# Altium project Driver Morpheu v4.0 SMD.PrjPcb
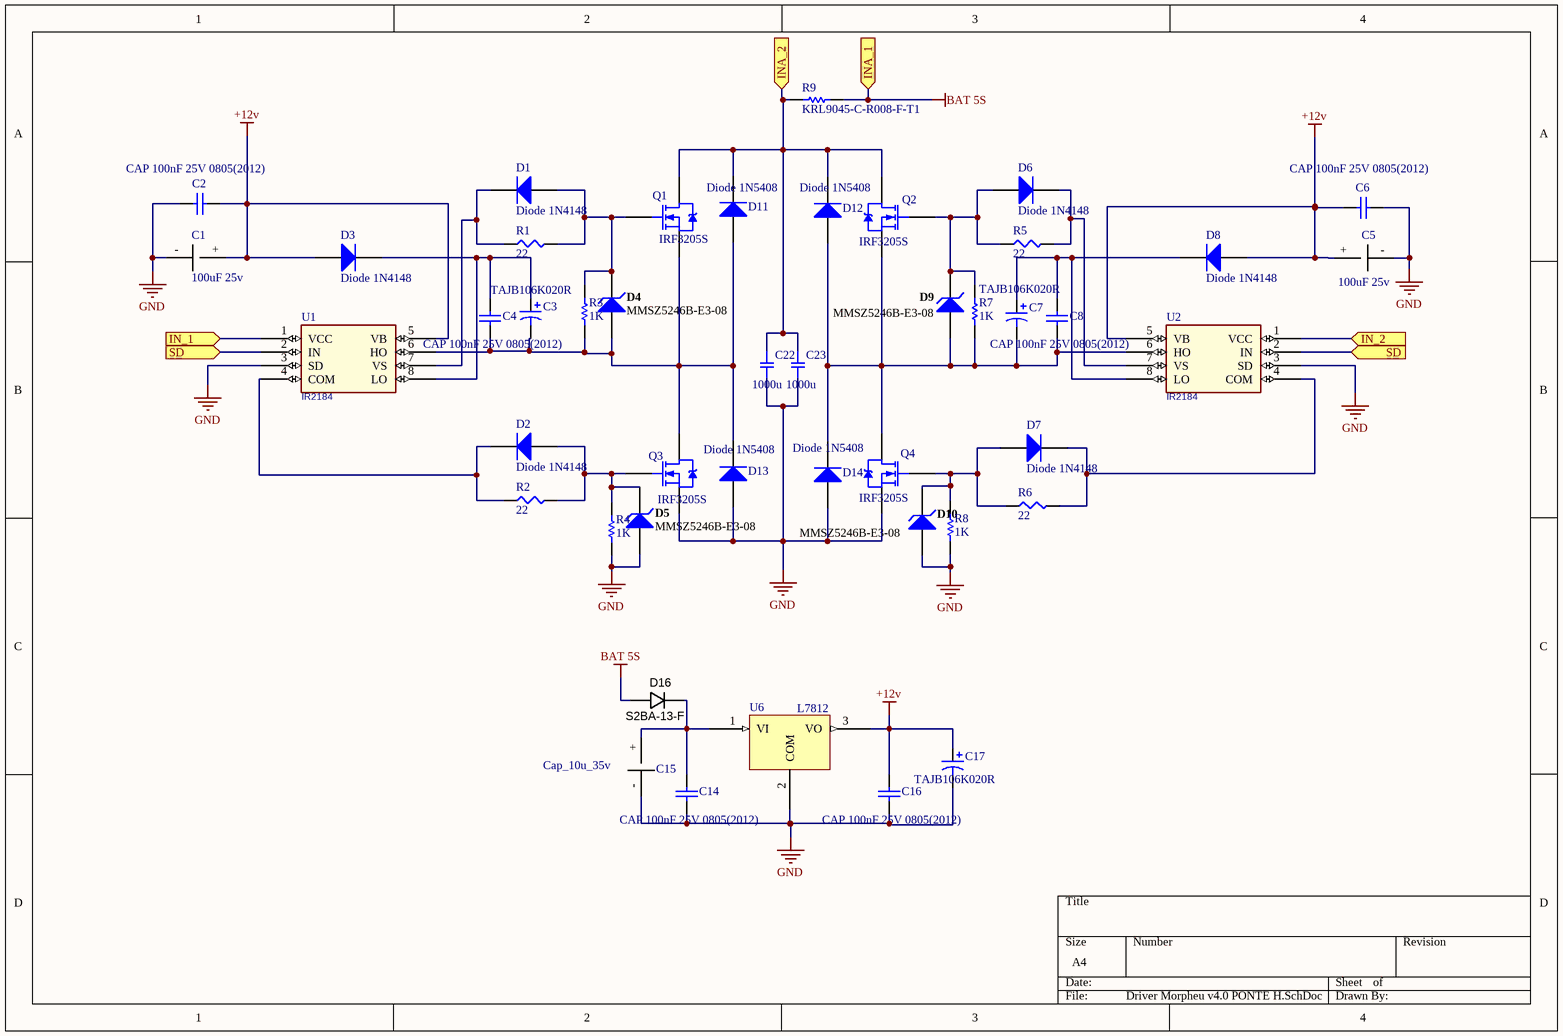
[diagram p0: Driver Morpheu v4.0 PONTE H.SchDoc]
3 sheets, 74 parts. Net scope: flat (ports and power ports of the same name join across sheets).
Board file: Driver Morpheu v4.0.PcbDoc
Sheets:
  Driver Morpheu v4.0 PONTE H.SchDoc
  Driver Morpheu v4.0 CENTRAL.SchDoc
  Driver Morpheu v4.0 SENSOR CORRENTE.SchDoc

## Sheet Driver Morpheu v4.0 PONTE H.SchDoc
size A4

### Parts
C1  100uF 25v  [CAP_100u_25v_Tantalum]
C2  CAP 100nF 25V 0805(2012)  [CAPC0805(2012)145_M]
C3  TAJB106K020R  [AVX-CAPC3528_V]
C4  CAP 100nF 25V 0805(2012)  [CAPC0805(2012)145_M]
C5  100uF 25v  [CAP_100u_25v_Tantalum]
C6  CAP 100nF 25V 0805(2012)  [CAPC0805(2012)145_M]
C7  TAJB106K020R  [AVX-CAPC3528_V]
C8  CAP 100nF 25V 0805(2012)  [CAPC0805(2012)145_M]
C14  CAP 100nF 25V 0805(2012)  [CAPC0805(2012)145_M]
C15  Cap_10u_35v  [CAP_100u_25v_Tantalum]
C16  CAP 100nF 25V 0805(2012)  [CAPC0805(2012)145_M]
C17  TAJB106K020R  [AVX-CAPC3528_V]
C22  1000u  [CAPAE250P680X1220_FLAT1]
C23  1000u  [CAPAE250P680X1220_FLAT1]
D1  Diode 1N4148  [SOD123]
D2  Diode 1N4148  [SOD123]
D3  Diode 1N4148  [SOD123]
D4  MMSZ5246B-E3-08  [VISH-SOD-123-2_V]
D5  MMSZ5246B-E3-08  [VISH-SOD-123-2_V]
D6  Diode 1N4148  [SOD123]
D7  Diode 1N4148  [SOD123]
D8  Diode 1N4148  [SOD123]
D9  MMSZ5246B-E3-08  [VISH-SOD-123-2_V]
D10  MMSZ5246B-E3-08  [VISH-SOD-123-2_V]
D11  Diode 1N5408  [DO-201AD]
D12  Diode 1N5408  [DO-201AD]
D13  Diode 1N5408  [DO-201AD]
D14  Diode 1N5408  [DO-201AD]
D16  Manufacturer Part Number 1: S2BA-13-F  [DO-214AC]  (hidden comment: 100V; 1.5A)
Q1  IRF3205S  [D2PAK_N]
Q2  IRF3205S  [D2PAK_N]
Q3  IRF3205S  [D2PAK_N]
Q4  IRF3205S  [D2PAK_N]
R1  22  [SMD-0603-RES]
R2  22  [SMD-0603-RES]
R3  value 1K  [RES-0402]  (hidden comment: RC0402JR-071KL)
R4  value 1K  [RES-0402]  (hidden comment: RC0402JR-071KL)
R5  22  [SMD-0603-RES]
R6  22  [SMD-0603-RES]
R7  value 1K  [RES-0402]  (hidden comment: RC0402JR-071KL)
R8  value 1K  [RES-0402]  (hidden comment: RC0402JR-071KL)
R9  KRL9045-C-R008-F-T1  [8m OHM 4W]
U1  IR2184  [SOIC127P600X175-8AN]
U2  IR2184  [SOIC127P600X175-8AN]
U6  L7812  [D2PAK-3]

### Ports
IN_1 (in), IN_2 (in), INA_1 (in), INA_2 (in), SD (in)

### Nets
+12v: C1.+ C2.2 C5.+ C6.2 C16.2 C17.1 D3.1(A) D8.1(A) U1.5(VB) U2.5(VB) U6.3(VO)
BAT 5S: D16.A R9.1 ; port INA_1
GND: C1.- C2.1 C5.- C6.1 C14.1 C15.- C16.1 C17.2 C22.2 C23.2 D5.1(A) D10.1(A) D13.1(A) D14.1(A) Q3.3(S) Q4.3(S) R4.1 R8.1 U1.3(SD) U2.3(SD) U6.2(COM)
NetC3_1: C3.1 C4.2 D3.2(K) U1.8(LO)
NetC3_2: C3.2 C4.1 D4.1(A) D11.1(A) D13.2(K) Q1.3(S) Q3.2(D) R3.1 U1.6(HO)
NetC7_1: C7.1 C8.2 D8.2(K) U2.8(LO)
NetC7_2: C7.2 C8.1 D9.1(A) D12.1(A) D14.2(K) Q2.3(S) Q4.2(D) R7.1 U2.6(HO)
NetC14_2: C14.2 C15.+ D16.K U6.1(VI)
NetC22_1: C22.1 C23.1 D11.2(K) D12.2(K) Q1.2(D) Q2.2(D) R9.2 ; port INA_2
NetD1_1: D1.1(A) D4.2(K) Q1.1(G) R1.2 R3.2
NetD1_2: D1.2(K) R1.1 U1.7(VS)
NetD2_1: D2.1(A) D5.2(K) Q3.1(G) R2.2 R4.2
NetD2_2: D2.2(K) R2.1 U1.4(COM)
NetD6_1: D6.1(A) D9.2(K) Q2.1(G) R5.1 R7.2
NetD6_2: D6.2(K) R5.2 U2.7(VS)
NetD7_1: D7.1(A) D10.2(K) Q4.1(G) R6.1 R8.2
NetD7_2: D7.2(K) R6.2 U2.4(COM)
NetDS2_1: U1.1(VCC) ; port IN_1
NetDS3_1: U2.1(VCC) ; port IN_2
NetU1_2: U1.2(IN) U2.2(IN) ; port SD

### Library data of the parts
C1 C5 = Cap_100u_25v: Cap Tântalo
C2 C4 C6 C8 C14 C16 = CMP-1036-04408-1: CAP 100nF 25V ±5% 0805 (2012 Metric) Thickness 1.45mm SMD; Case-Metric: 2012; Case-EIA: 0805; Tolerance: Â±5%; Value: 100nF; Rated Voltage: 25 V; Max Thickness: 1.45 mm; Technology: SMT
C3 C7 C17 = CMP-0279-00001-1: Capacitor, Tantalum, 10uF 10% 20V MCCT-B (3528); Manufacturer: AVX; Polarity: Polarized; PartNumber: TAJB106K020R; PackageDescription: 2-Pin SMT Capacitor, 3.5 x 2.8 mm Body; ComponentLink1URL: http://www.avx.com/; PackageReference: CAPC3528; ComponentLink2Description: Datasheet; Capacitance: 10uF; Technology: Tantalum; ComponentLink2URL: http://www.avx.com/docs/Catalogs/taj.pdf; Tolerance: 10%; ComponentLink1Description: Manufacturer URL; Rated Voltage: 20V; DatasheetVersion: Jun-13; Mounting Technology: Surface Mount
C22 C23 = CAPACITOR: CAP MLCC SMT
D1-D3 D6-D8 = Diode 1N4148: High Conductance Fast Diode; Published: 8-Jun-2000; LatestRevisionDate: 17-Jul-2002; LatestRevisionNote: Re-released for DXP Platform.; DatasheetVersion: 1997; PackageReference: DO-35; Publisher: Altium Limited; PackageDescription: Diode, Axial; Body 3.8 x 1.9 mm (LxDia. max), Lead Dia. 0.53 mm (max); Code_JEDEC: DO-204-AH; ComponentLink1Description: Manufacturer Link; ComponentLink1URL: http://www.fairchildsemi.com/; ComponentLink2Description: Datasheet; ComponentLink2URL: http://www.fairchildsemi.com/ds/1N%2F1N4148.pdf
D4 D5 D9 D10 = CMP-0931-00032-1: Small Signal Zener Diode, 16 V +/- 5%, -55 to 155 degC, 2-Pin SOD-123, RoHS, Tape and Reel; Manufacturer: Vishay Semiconductor; Test Current (IZT1) (mA): 7.8; Zener Impedance (IZT1) (Max.) (Ohm): 17; Int. Construction: Single; Tolerance: +/- 5%; Power Dissipation (mW): 500; Zener Voltage (NOM.) (V): 16; ComponentLink1URL: http://www.vishay.com/; PackageReference: SOD-123-2; PartNumber: MMSZ5246B-E3-08; ComponentLink2Description: Datasheet; Operating Temperature: -55 to 150 degC; PackageDescription: 2-Pin SMD, Body 2.7 x 1.55 mm, Height 1.35 mm; ComponentLink2URL: http://www.vishay.com/docs/85774/mmsz5225.pdf; DatasheetVersion: Rev. 1.9; RoHS: TRUE; Packing: Tape and Reel; ComponentLink1Description: Manufacturer URL; Mounting Technology: Surface Mount; PackageVersion: Rev. 1.9; ComponentLink3URL: http://www.vishay.com/docs/85774/mmsz5225.pdf; ComponentLink3Description: Package Specification
D11-D14 = Diode 1N5408: 3 Amp Medium Power Silicon Rectifier Diode; Published: 8-Jun-2000; LatestRevisionDate: 17-Jul-2002; LatestRevisionNote: Re-released for DXP Platform.; DatasheetVersion: Aug-1984; PackageReference: DO-201AD; Publisher: Altium Limited; PackageDescription: Diode, Axial; Body 9.5 x 5.3 mm (LxDia. max), Lead Dia. 1.32 mm (max); ComponentLink1Description: Manufacturer Link; ComponentLink1URL: http://www.irf.com/
D16 = DIODE_100V_1.5A_SMA: Diode SMD 100V 1.5A SMA; Manufacturer 1: Diodes Inc; Material: Si; Diode Type: Standard; Value: Vf = 1.15V @ 1.5A (Max); SCDType: source; Package / Case: DO-214AC, SMA; Ratings: 100V; 1.5A; Supplier 1: Digi-Key; Supplier Part Number 1: S2BA-FDICT-ND
Q1-Q4 = IRF3205S: HEXFET Power MOSFET; Published: 8-Jun-2000; LatestRevisionDate: 20-Nov-2009; LatestRevisionNote: IPC-7351 Footprint Added.; DatasheetVersion: Aug-1997; PackageReference: D2PAK; Publisher: Altium Limited; PackageDescription: 3-Pin Transistor Outline Package 2.54 mm Pitch, 15.1 mm Lead Span; ComponentLink1Description: Manufacturer Link; ComponentLink1URL: http://www.irf.com/; ComponentLink2Description: Datasheet; ComponentLink2URL: http://www.irf.com/product-info/datasheets/data/irf3205s.pdf
R1 R2 R5 R6 = ERJ-3EKF22R0V: RES SMD 22 OHM 1% 1/10W 0603; Manufacturer: Panasonic Electronic Components; Factory Stock: 0; Unit Price (USD): 0.00379; @ qty: 1500; Minimum Quantity: 1; Power (Watts): 0.1W, 1/10W; Temperature Coefficient: ±100ppm/°C; Part Number: ERJ-3EKF22R0V; Datasheets: http://industrial.panasonic.com/www-cgi/jvcr13pz.cgi?E+PZ+3+AOA0002+ERJ3EKF22R0V+7+WW; Image: //media.digikey.com/Photos/Panasonic%20Photos/MFG_ERJ-P6W%20Series.jpg; Digi-Key Part Number: P22.0HCT-ND; Quantity Available: 100321; Packaging: Cut Tape (CT); Series: ERJ; Part Status: Active; Value: 22; Tolerance: ±1%; Composition: Thick Film; Features: Automotive AEC-Q200; Operating Temperature: -55°C ~ 155°C; Package / Case: 0603 (1608 Metric); Supplier Device Package: 0603; Size / Dimension: 0.063" L x 0.031" W (1.60mm x 0.80mm); Height - Seated (Max): 0.022" (0.55mm); Number of Terminations: 2; Failure Rate: -
R3 R4 R7 R8 = RES 1K 0402: RES SMD 1K OHM 5% 1/16W 0402
R9 = CMP-1666-00018-2: Chip Resistor, 0.008 Ohm, +/- 1%, 4 W; PartNumber: WSLP12061L000FEA; Resistance: 0.001 Ohm; RoHSCompliant: True; Mounting Technology: Surface Mount; ComponentLink1URL: http://www.vishay.com/; Min Operating Temperature: -65 degC; Height: 0.635 mm; ComponentLink2URL: http://www.farnell.com/datasheets/2049155.pdf; Length: 3.2 mm; ComponentLink2Description: Datasheet; ComponentLink1Description: Manufacturer URL; DatasheetVersion: 04/2015; Case Code (Imperial): 1206; Max Operating Temperature: 170 degC; Packaging: Tape and Reel; Tolerance: 1%; Case/Package: 1206; Width: 1.6 mm; REACH SVHC: Unknown; PackageDescription: 2-Pin Surface Mount Device, Body 3.2 x 1.6 mm; Case Code (Metric): 3216
U1 U2 = IR2184: PSpiceTemplate: X^@REFDES %VCC %IN %SD %COM %VB %HO %VS %LO @MODEL PARAMS:  ?CDELAY|CDELAY=@CDELAY||CDELAY=50N| ?RDELAY|RDELAY=@RDELAY||RDELAY=50| ?T1|T1=@T1||T1=-40| ?T2|T2=@T2||T2=25| ?T3|T3=@T3||T3=125| ?V1|V1=@V1||V1=10| ?V2|V2=@V2||V2=15| ?V3|V3=@V3||V3=20| ?TOFFT1|TOFFT1=@TOFFT1||TOFFT1=270N| ?TOFFT2|TOFFT2=@TOFFT2||TOFFT2=270N| ?TOFFT3|TOFFT3=@TOFFT3||TOFFT3=270N| ?TOFFV1|TOFFV1=@TOFFV1||TOFFV1=270N| ?TOFFV2|TOFFV2=@TOFFV2||TOFFV2=270N| ?TOFFV3|TOFFV3=@TOFFV3||TOFFV3=270N| ?TONT1|TONT1=@TONT1||TONT1=210N| ?TONT2|TONT2=@TONT2||TONT2=210N| ?TONT3|TONT3=@TONT3||TONT3=210N| ?TONV1|TONV1=@TONV1||TONV1=210N| ?TONV2|TONV2=@TONV2||TONV2=210N| ?TONV3|TONV3=@TONV3||TONV3=210N|; TONV3: 210N; TOFFV3: 270N; V3: 20; V2: 15; V1: 10; T3: 125; T2: 25; T1: -40; RDELAY: 50; CDELAY: 50N; TONV2: 210N; TONV1: 210N; TONT3: 210N; TONT2: 210N; TONT1: 210N; TOFFV2: 270N; TOFFV1: 270N; TOFFT3: 270N; TOFFT2: 270N; TOFFT1: 270N
U6 = LM7812

## Sheet Driver Morpheu v4.0 CENTRAL.SchDoc
size A4
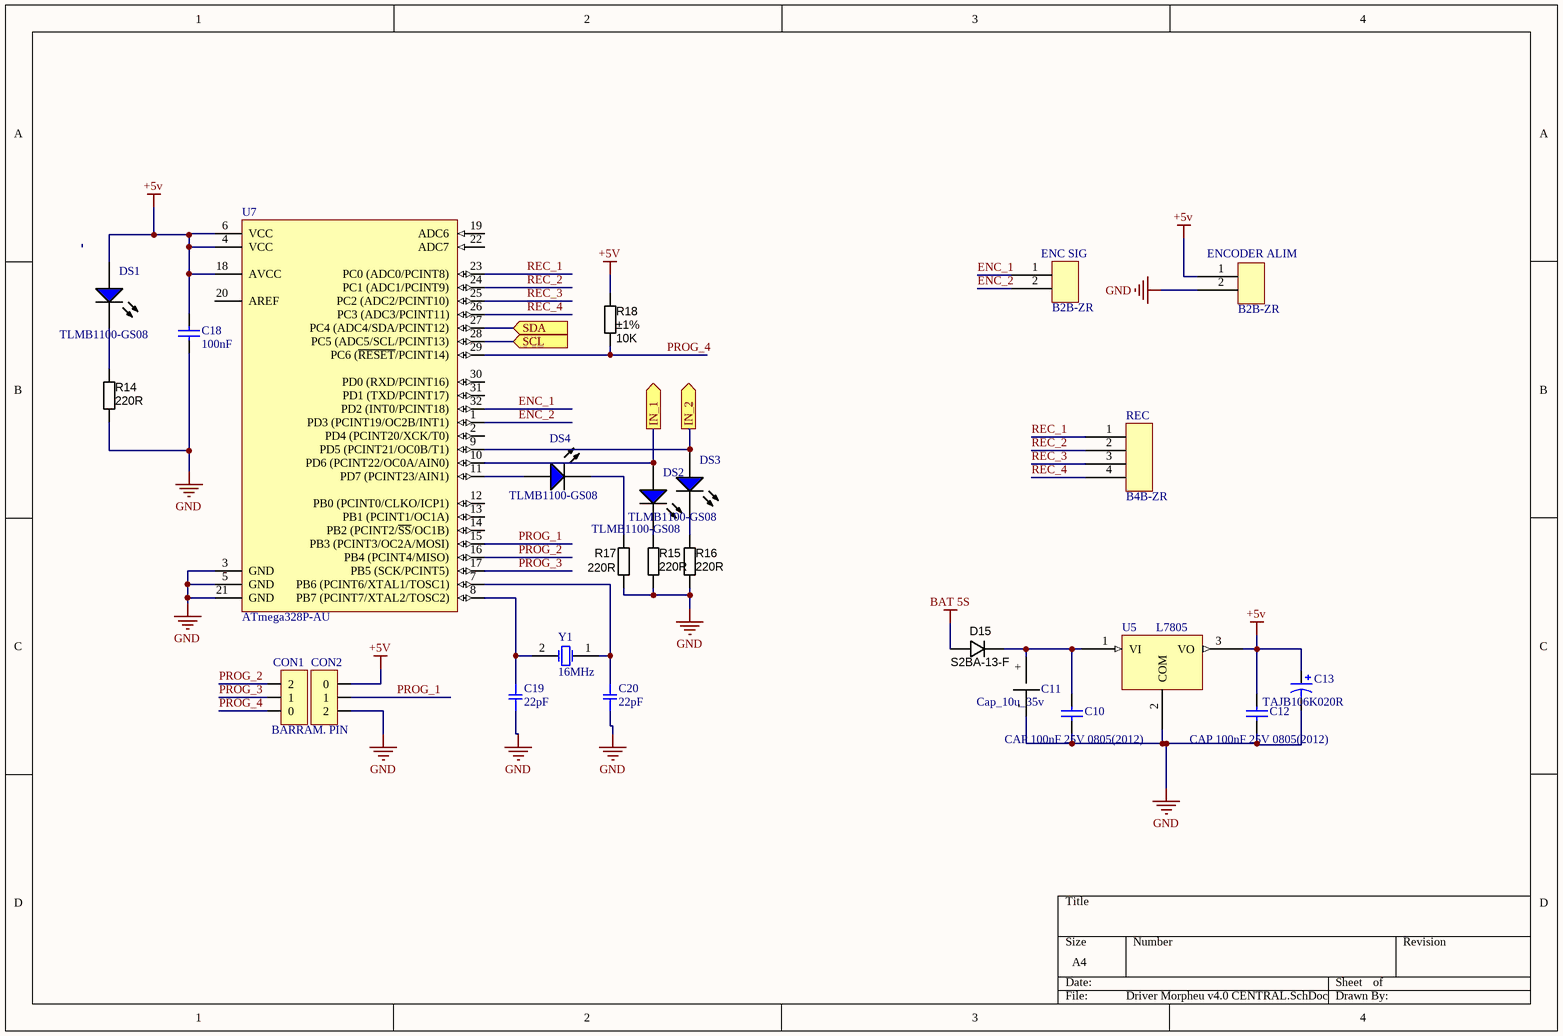
[diagram p1: Driver Morpheu v4.0 CENTRAL.SchDoc]

### Parts
C10  CAP 100nF 25V 0805(2012)  [CAPC0805(2012)145_M]
C11  Cap_10u_35v  [CAP_100u_25v_Tantalum]
C12  CAP 100nF 25V 0805(2012)  [CAPC0805(2012)145_M]
C13  TAJB106K020R  [AVX-CAPC3528_V]
C18  value 100nF  [CAP-0402]  (hidden comment: GRM155R71C104KA88D)
C19  22pF  [SMD-0603C]
C20  22pF  [SMD-0603C]
CON1  BARRAM. PIN  [1x3POS_HEADER]
CON2  (no value)  [1x3POS_HEADER]
D15  Manufacturer Part Number 1: S2BA-13-F  [DO-214AC]  (hidden comment: 100V; 1.5A)
DS1  TLMB1100-GS08  [VISH-TLMX1100-2_V]
DS2  TLMB1100-GS08  [VISH-TLMX1100-2_V]
DS3  TLMB1100-GS08  [VISH-TLMX1100-2_V]
DS4  TLMB1100-GS08  [VISH-TLMX1100-2_V]
ENC_SIG  B2B-ZR  [B2B-ZR]
ENCODER_ALIM  B2B-ZR  [B2B-ZR]
R14  value 220R  [RESC1608X55N]  (hidden comment: Thick Film)
R15  value 220R  [RESC1608X55N]  (hidden comment: Thick Film)
R16  value 220R  [RESC1608X55N]  (hidden comment: Thick Film)
R17  value 220R  [RESC1608X55N]  (hidden comment: Thick Film)
R18  value 10K  Tolerance: ±1%  [RESC1608X55N]  (hidden comment: Thick Film)
REC  B4B-ZR  [B4B-ZR]
U5  L7805  [D2PAK-3]
U7  ATmega328P-AU  [32A_N]
Y1  16MHz  [CRYSTAL_HC49-US-SM]

### Ports
IN_1 (out), IN_2 (out), SCL (in), SDA (in)

### Nets
+5V: C12.2 C13.1 C18.1 CON2.0 DS1.1(A) ENCODER_ALIM.1 R18.1 U5.3(VO) U7.4(VCC) U7.6(VCC) U7.18(AVCC)
BAT 5S: D15.A
GND: C10.1 C11.- C12.1 C13.2 C18.2 C19.1 C20.1 CON2.2 ENCODER_ALIM.2 R14.2 R15.2 R16.2 R17.2 U5.2(COM) U7.3(GND) U7.5(GND) U7.21(GND)
ENC_1: ENC_SIG.1 U7.32(PD2_(INT0/PCINT18))
ENC_2: ENC_SIG.2 U7.1(PD3_(PCINT19/OC2B/INT1))
PROG_1: CON2.1 U7.15(PB3_(PCINT3/OC2A/MOSI))
PROG_2: CON1.2 U7.16(PB4_(PCINT4/MISO))
PROG_3: CON1.1 U7.17(PB5_(SCK/PCINT5))
PROG_4: CON1.0 R18.2 U7.29(PC6_(~{RESET}/PCINT14))
REC_1: REC.1 U7.23(PC0_(ADC0/PCINT8))
REC_2: REC.2 U7.24(PC1_(ADC1/PCINT9))
REC_3: REC.3 U7.25(PC2_(ADC2/PCINT10))
REC_4: REC.4 U7.26(PC3_(ADC3/PCINT11))
NetC10_2: C10.2 C11.+ D15.K U5.1(VI)
NetC19_2: C19.2 U7.8(PB7_(PCINT7/XTAL2/TOSC2)) Y1.2(OSC2)
NetC20_2: C20.2 U7.7(PB6_(PCINT6/XTAL1/TOSC1)) Y1.1(OSC1)
NetDS1_2: DS1.2(K) R14.1
NetDS2_1: DS2.1(A) U7.10(PD6_(PCINT22/OC0A/AIN0)) ; port IN_1
NetDS2_2: DS2.2(K) R15.1
NetDS3_1: DS3.1(A) U7.9(PD5_(PCINT21/OC0B/T1)) ; port IN_2
NetDS3_2: DS3.2(K) R16.1
NetDS4_1: DS4.1(A) U7.11(PD7_(PCINT23/AIN1))
NetDS4_2: DS4.2(K) R17.1
NetR12_2: U7.27(PC4_(ADC4/SDA/PCINT12)) ; port SDA
NetR13_2: U7.28(PC5_(ADC5/SCL/PCINT13)) ; port SCL

Not connected (* = marked no-connect by the designer): U7 2(PD4_(PCINT20/XCK/T0)) 12(PB0_(PCINT0/CLKO/ICP1)) 13(PB1_(PCINT1/OC1A)) 14(PB2_(PCINT2/~{SS}/OC1B)) 19(ADC6) 20(AREF) 22(ADC7) 30(PD0_(RXD/PCINT16)) 31(PD1_(TXD/PCINT17))

### Library data of the parts
C10 C12 = CMP-1036-04408-1: as C2 on sheet Driver Morpheu v4.0 PONTE H; Value: 100nF; Rated Voltage: 25 V; Max Thickness: 1.45 mm; Technology: SMT
C13 = CMP-0279-00001-1: as C3 on sheet Driver Morpheu v4.0 PONTE H; PartNumber: TAJB106K020R; PackageDescription: 2-Pin SMT Capacitor, 3.5 x 2.8 mm Body; ComponentLink1URL: http://www.avx.com/; PackageReference: CAPC3528; ComponentLink2Description: Datasheet; Capacitance: 10uF; Technology: Tantalum; ComponentLink2URL: http://www.avx.com/docs/Catalogs/taj.pdf; Tolerance: 10%; ComponentLink1Description: Manufacturer URL; Rated Voltage: 20V; DatasheetVersion: Jun-13; Mounting Technology: Surface Mount
C18 = Cap 100nF 0402: 0.10µF 16V Ceramic Capacitor X7R 0402 (1005 Metric) 0.039" L x 0.020" W (1.00mm x 0.50mm)
C19 C20 = GQM1885C1H220GB01D: CAP CER 22PF 50V NP0 0603; Manufacturer: Murata Electronics North America; Factory Stock: 0; Unit Price (USD): 1,07; Minimum Quantity: 1; Tolerance: ±2%; Temperature Coefficient: C0G, NP0; Part Number: GQM1885C1H220GB01D; Datasheets: http://www.murata.com/~/media/webrenewal/support/library/catalog/products/capacitor/mlcc/c02e.pdf; Image: //media.digikey.com/Renders/Murata%20Renders/0603%28LQG18%29.jpg; Digi-Key Part Number: 490-6089-1-ND; Quantity Available: 2359; @ qty: 0; Packaging: Cut Tape (CT); Series: GQM; Part Status: Active; Value: 22pF; Voltage: 50V; Operating Temperature: -55°C ~ 125°C; Features: High Q, Low Loss; Ratings: -; Applications: RF, Microwave, High Frequency; Mounting Type: Surface Mount, MLCC; Package / Case: 0603 (1608 Metric); Size / Dimension: 0.063" L x 0.031" W (1.60mm x 0.80mm); Height - Seated (Max): -; Thickness (Max): 0.035" (0.90mm); Lead Spacing: -; Lead Style: -
CON1 CON2 = 03x01_Conector_Male_Shroudred: CONN HEADER XH TOP 3POS 2.5MM
D15 = DIODE_100V_1.5A_SMA: as D16 on sheet Driver Morpheu v4.0 PONTE H; Package / Case: DO-214AC, SMA; Ratings: 100V; 1.5A; Supplier 1: Digi-Key; Supplier Part Number 1: S2BA-FDICT-ND
DS1 = CMP-1666-00028-1: Red LED, 10 mA, 3.9 V, -40 to 100 degC, 2-Pin SMD (0603), RoHS, Tape and Reel; Tolerance: 10%; Voltage Rating: 100 V; Capacitance: 10 nF; Type (Capacitors): X7R; Case\Package: Radial; ComponentLink1Description: Manufacturer URL; REACH SVHC: No SVHC; Package Quantity: 500; PackageDescription: 2-Pin Surface Mount Device, Body 1.6 x 0.8 mm; Pins: 2; ComponentLink2URL: http://download.siliconexpert.com/pdfs/2016/8/7/12/43/26/667/vsh_/manual/379263299541529tlmb1100.pdf; RoHSCompliant: true; Lead Pitch: 2.54 mm; Height: 2.54 mm; DatasheetVersion: Rev. 2.7, 03/2016; Length: 5.33 mm; ComponentLink1URL: http://www.vishay.com/; Min Operating Temperature: -55 degC; PackageReference: 0603; Packaging: Bulk; ComponentLink2Description: Datasheet; Max Operating Temperature: 125 degC; Radiation Hardening: No; Width: 3.81 mm; Mount: Through Hole
DS2 DS3 = CMP-1666-00028-1: Blue LED, 10 mA, 3.9 V, -40 to 100 degC, 2-Pin SMD (0603), RoHS, Tape and Reel; Tolerance: 10%; Voltage Rating: 100 V; Capacitance: 10 nF; Type (Capacitors): X7R; Case\Package: Radial; ComponentLink1Description: Manufacturer URL; REACH SVHC: No SVHC; Package Quantity: 500; PackageDescription: 2-Pin Surface Mount Device, Body 1.6 x 0.8 mm; Pins: 2; ComponentLink2URL: http://download.siliconexpert.com/pdfs/2016/8/7/12/43/26/667/vsh_/manual/379263299541529tlmb1100.pdf; RoHSCompliant: true; Lead Pitch: 2.54 mm; Height: 2.54 mm; DatasheetVersion: Rev. 2.7, 03/2016; Length: 5.33 mm; ComponentLink1URL: http://www.vishay.com/; Min Operating Temperature: -55 degC; PackageReference: 0603; Packaging: Bulk; ComponentLink2Description: Datasheet; Max Operating Temperature: 125 degC; Radiation Hardening: No; Width: 3.81 mm; Mount: Through Hole
DS4 = CMP-1666-00028-1: Green LED, 10 mA, 3.9 V, -40 to 100 degC, 2-Pin SMD (0603), RoHS, Tape and Reel; Tolerance: 10%; Voltage Rating: 100 V; Capacitance: 10 nF; Type (Capacitors): X7R; Case\Package: Radial; ComponentLink1Description: Manufacturer URL; REACH SVHC: No SVHC; Package Quantity: 500; PackageDescription: 2-Pin Surface Mount Device, Body 1.6 x 0.8 mm; Pins: 2; ComponentLink2URL: http://download.siliconexpert.com/pdfs/2016/8/7/12/43/26/667/vsh_/manual/379263299541529tlmb1100.pdf; RoHSCompliant: true; Lead Pitch: 2.54 mm; Height: 2.54 mm; DatasheetVersion: Rev. 2.7, 03/2016; Length: 5.33 mm; ComponentLink1URL: http://www.vishay.com/; Min Operating Temperature: -55 degC; PackageReference: 0603; Packaging: Bulk; ComponentLink2Description: Datasheet; Max Operating Temperature: 125 degC; Radiation Hardening: No; Width: 3.81 mm; Mount: Through Hole
R14-R17 = RES_220R_0603_5%: Resistor SMD chip 220 Ohm 0.1W 5% 0603; Manufacturer 1: Yageo; Manufacturer Part Number 1: RC0603JR-07220RL; Ratings: 1/10 W; SCDType: spec; Manufacturer 5: Royal Ohm; Manufacturer Part Number 5: 0603WAJ0221; Package / Case: 0603 (1608 metric); Tolerance: ±5%; Material: Thick Film; Supplier 1: Digi-Key; Supplier Part Number 1: 311-220GRCT-ND; Supplier 2: Digi-Key; Supplier Part Number 2: P220GCT-ND; Manufacturer 2: Panasonic Electronic Components; Manufacturer Part Number 2: ERJ-3GEYJ221V; RoHS 2: RoHS Compliant; ComponentLink2URL: http://industrial.panasonic.com/www-cgi/jvcr13pz.cgi?E+PZ+3+AOA0001+ERJ3GEYJ221V+7+WW; ComponentLink2Description: http://industrial.panasonic.com/www-cgi/jvcr13pz.cgi?E+PZ+3+AOA0001+ERJ3GEYJ221V+7+WW; ComponentLink1URL: http://www.yageo.com/documents/recent/PYu-RC0603_51_RoHS_L_4.pdf; ComponentLink1Description: http://www.yageo.com/documents/recent/PYu-RC0603_51_RoHS_L_4.pdf; Supplier 3: Digi-Key; Supplier Part Number 3: RMCF0603JT220RCT-ND; Manufacturer 3: Stackpole Electronics Inc; Manufacturer Part Number 3: RMCF0603JT220R; RoHS 3: RoHS Compliant; ComponentLink3URL: http://www.seielect.com/Catalog/SEI-RMCF_RMCP.pdf; ComponentLink3Description: http://www.seielect.com/Catalog/SEI-RMCF_RMCP.pdf; Supplier 4: Digi-Key; Supplier Part Number 4: RHM220CGCT-ND; Manufacturer 4: Rohm Semiconductor; Manufacturer Part Number 4: MCR03ERTJ221; RoHS 4: RoHS Compliant; ComponentLink4URL: http://rohmfs.rohm.com/en/products/databook/datasheet/passive/resistor/chip_resistor/mcr_g.pdf; ComponentLink4Description: http://rohmfs.rohm.com/en/products/databook/datasheet/passive/resistor/chip_resistor/mcr_g.pdf; RoHS 1: RoHS Compliant
R18 = RES_10K_0603_1%: Resistor SMD chip 10k Ohm 0.1W 1% 0603; Manufacturer 1: Yageo; Manufacturer Part Number 1: RC0603FR-0710KL; Ratings: 1/10W; SCDType: spec; Package / Case: 0603 (1608 Metric); Supplier 1: Digi-Key; Supplier Part Number 1: 311-10.0KHRCT-ND
U5 = LM7805
U7 = ATmega328P-AU: 8-bit AVR Microcontroller, 32KB Flash, 1KB EEPROM, 2KB SRAM, 32-pin TQFP, Industrial Grade (-40°C to 85°C); DatasheetVersion: revD, May-2011; PackageVersion: revC, Oct-2010; PackageReference: 32A; PackageDescription: 32-Lead, 7x7x1.0 mm Body, 0.8mm Lead Pitch, Thin Profile Plastic Quad Flat Package (TQFP); Code_JEDEC: MS-026-ABA; ComponentLink1Description: Manufacturer URL; ComponentLink1URL: http://www.atmel.com/; ComponentLink2Description: ATmega48A/48PA/88A/88PA/168A/168PA/328/328P Datasheet; ComponentLink2URL: http://www.atmel.com/dyn/resources/prod_documents/doc8271.pdf; ComponentLink3Description: ATmega48A/48PA/88A/88PA/168A/168PA/328/328P Summary; ComponentLink3URL: http://www.atmel.com/dyn/resources/prod_documents/8271S.pdf
Y1 = XTAL: Crystal Oscillator; Published: 8-Jun-2000; LatestRevisionDate: 17-Jul-2002; LatestRevisionNote: Re-released for DXP Platform.; PackageReference: R38; Publisher: Altium Limited; PackageDescription: Crystal, Thru-Hole; 2 Leads; Body 3.1 x 8.2 mm (Dia.xH)

## Sheet Driver Morpheu v4.0 SENSOR CORRENTE.SchDoc
size A4
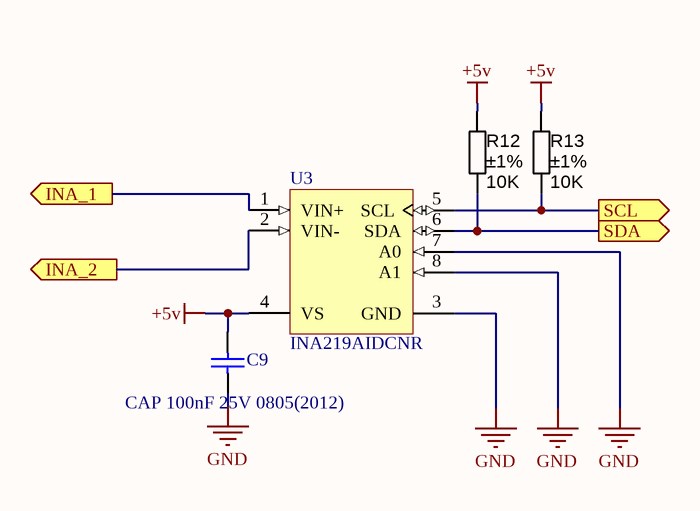
[diagram p2: Driver Morpheu v4.0 SENSOR CORRENTE.SchDoc]

### Parts
C9  CAP 100nF 25V 0805(2012)  [CAPC0805(2012)145_M]
R12  value 10K  Tolerance: ±1%  [RESC1608X55N]  (hidden comment: Thick Film)
R13  value 10K  Tolerance: ±1%  [RESC1608X55N]  (hidden comment: Thick Film)
U3  INA219AIDCNR  [DCN0008A_M]

### Ports
INA_1 (out), INA_2 (out), SCL (out), SDA (out)

### Nets
+5V: C9.2 R12.1 R13.1 U3.4(VS)
BAT 5S: U3.1(VIN+) ; port INA_1
GND: C9.1 U3.3(GND) U3.7(A0) U3.8(A1)
NetC22_1: U3.2(VIN-) ; port INA_2
NetR12_2: R12.2 U3.6(SDA) ; port SDA
NetR13_2: R13.2 U3.5(SCL) ; port SCL

### Library data of the parts
C9 = CMP-1036-04408-1: as C2 on sheet Driver Morpheu v4.0 PONTE H; Value: 100nF; Rated Voltage: 25 V; Max Thickness: 1.45 mm; Technology: SMT
R12 R13 = RES_10K_0603_1%: as R18 on sheet Driver Morpheu v4.0 CENTRAL; Package / Case: 0603 (1608 Metric); Supplier 1: Digi-Key; Supplier Part Number 1: 311-10.0KHRCT-ND
U3 = CMP-0704-00041-2: Zero-Drift, Bi-directional Current / Power Monitor, 3 to 5.5 V, -40 to 125 degC, 8-pin SOP (DCN8), Green (RoHS & no Sb/Br); Manufacturer: Texas Instruments; Input Offset (+/-)(Max)(uV): 100; Small-Signal Bandwidth(Typ)(MHz): 0.011; SubFamily: Current Shunt Monitor; Rating: Catalog; Quiescent Current (+/-)(Typ)(mA): 0.7; Vs(Max)(V): 5.5; Common Mode Range(Min)(V): 0; Vs(Min)(V): 3; Common Mode Range(Max)(V): 26; Gain(V/V): 1, 0.5, 0.25, 0.125; ComponentLink3URL: http://www.ti.com/lit/ml/mpds099c/mpds099c.pdf; ComponentLink2URL: http://www.ti.com/general/docs/lit/getliterature.tsp?genericPartNumber=INA219&fileType=pdf; PackageReference: DCN0008A; ComponentLink1URL: http://www.ti.com/; ComponentLink1Description: Manufacturer URL; Code_JEDEC: MO-178; CMRR(Min)(dB): 100; DatasheetVersion: SBOS448F; Mounting Technology: Surface Mount; ComponentLink3Description: Package Specification; PartNumber: INA219AIDCNR; PackageVersion: 4202106/D, 11/2009; Eco-Plan: Green (RoHS & no Sb/Br); ComponentLink2Description: Datasheet; PackageDescription: 8-Pin Plastic Small Outline, Body 1.6 x 2.9 mm, Pitch 0.65 mm

## Nets that join several sheets
+5V: Driver Morpheu v4.0 CENTRAL (11 pins), Driver Morpheu v4.0 SENSOR CORRENTE (C9.2 R12.1 R13.1 U3.4)
BAT 5S: Driver Morpheu v4.0 PONTE H (D16.A R9.1), Driver Morpheu v4.0 CENTRAL (D15.A), Driver Morpheu v4.0 SENSOR CORRENTE (U3.1)
GND: Driver Morpheu v4.0 PONTE H (21 pins), Driver Morpheu v4.0 CENTRAL (17 pins), Driver Morpheu v4.0 SENSOR CORRENTE (C9.1 U3.3 U3.7 U3.8)
NetC22_1: Driver Morpheu v4.0 PONTE H (7 pins), Driver Morpheu v4.0 SENSOR CORRENTE (U3.2)
NetDS2_1: Driver Morpheu v4.0 PONTE H (U1.1), Driver Morpheu v4.0 CENTRAL (DS2.1 U7.10)
NetDS3_1: Driver Morpheu v4.0 PONTE H (U2.1), Driver Morpheu v4.0 CENTRAL (DS3.1 U7.9)
NetR12_2: Driver Morpheu v4.0 CENTRAL (U7.27), Driver Morpheu v4.0 SENSOR CORRENTE (R12.2 U3.6)
NetR13_2: Driver Morpheu v4.0 CENTRAL (U7.28), Driver Morpheu v4.0 SENSOR CORRENTE (R13.2 U3.5)